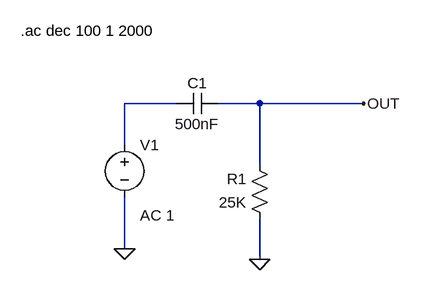
[diagram p0: schematic rc_highpass.asc]
rc_highpass.asc, the LTspice schematic file:
Version 4
SHEET 1 880 680
WIRE 80 64 0 64
WIRE 208 64 144 64
WIRE 368 64 208 64
WIRE 0 128 0 64
WIRE 208 160 208 64
WIRE 0 288 0 208
WIRE 208 304 208 240
FLAG 0 288 0
FLAG 208 304 0
FLAG 368 64 OUT
SYMBOL res 224 256 R180
WINDOW 0 36 76 Left 2
WINDOW 3 36 40 Left 2
SYMATTR InstName R1
SYMATTR Value 25K
SYMBOL cap 144 48 R90
WINDOW 0 0 32 VBottom 2
WINDOW 3 32 32 VTop 2
SYMATTR InstName C1
SYMATTR Value 500nF
SYMBOL voltage 0 112 R0
WINDOW 123 24 124 Left 2
WINDOW 39 0 0 Left 0
SYMATTR InstName V1
SYMATTR Value ""
SYMATTR Value2 AC 1
TEXT -160 -48 Left 2 !.ac dec 100 1 2000

The netlist it stands for:
* rc_highpass.asc
R1 0 OUT 25K
C1 OUT N001 500nF
V1 N001 0 AC 1
.ac dec 100 1 2000
.backanno
.end